# EAGLE design power-monitor (EAGLE 6.3)
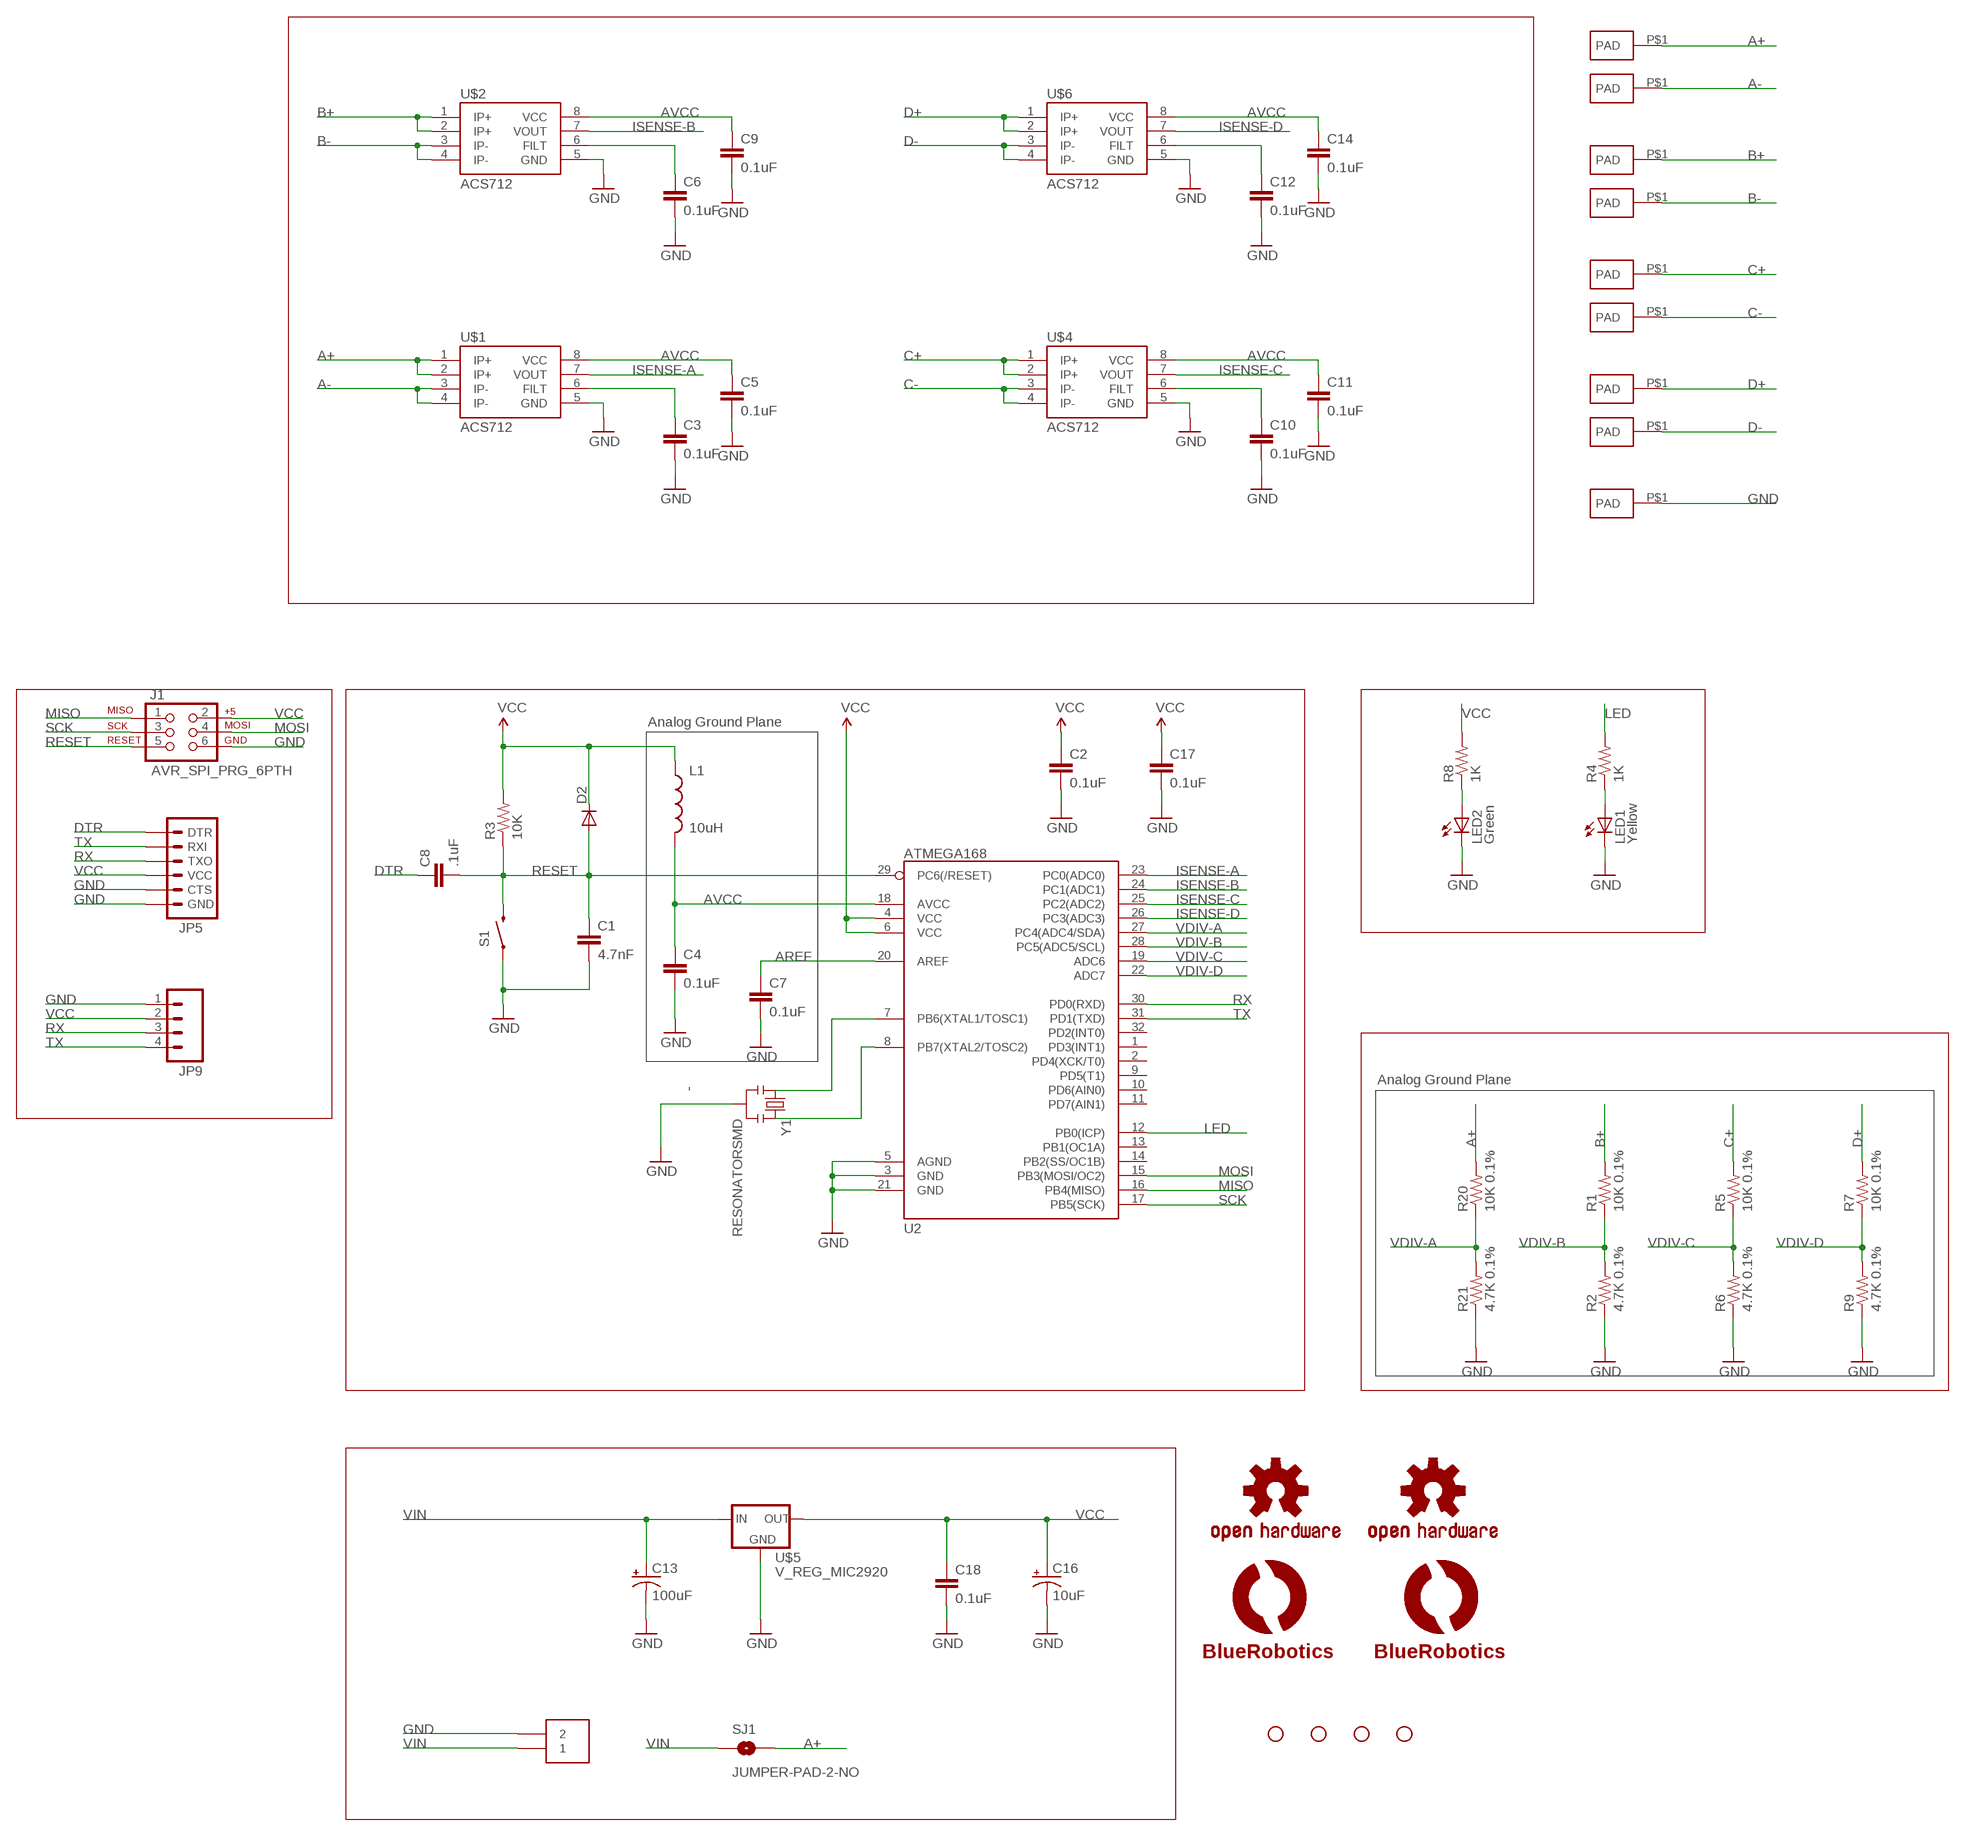
[diagram p0: schematic, sheet 1]

## Parts
C1  4.7nF  CAP0603-CAP  [0603-CAP]
C2  0.1uF  CAP0603-CAP  [0603-CAP]
C3  0.1uF  CAP0603-CAP  [0603-CAP]
C4  0.1uF  CAP0603-CAP  [0603-CAP]
C5  0.1uF  CAP0603-CAP  [0603-CAP]
C6  0.1uF  CAP0603-CAP  [0603-CAP]
C7  0.1uF  CAP0603-CAP  [0603-CAP]
C8  .1uF  CAP0603-CAP  [0603-CAP]
C9  0.1uF  CAP0603-CAP  [0603-CAP]
C10  0.1uF  CAP0603-CAP  [0603-CAP]
C11  0.1uF  CAP0603-CAP  [0603-CAP]
C12  0.1uF  CAP0603-CAP  [0603-CAP]
C13  100uF  CAP_POLPTH1  [CPOL-RADIAL-100UF-25V]
C14  0.1uF  CAP0603-CAP  [0603-CAP]
C16  10uF  CAP_POL1206  [EIA3216]
C17  0.1uF  CAP0603-CAP  [0603-CAP]
C18  0.1uF  CAP0603-CAP  [0603-CAP]
D2  DIODESOD  [SOD-323]
J1  AVR_SPI_PRG_6PTH  [2X3]
JP5  ARDUINO_SERIAL_PROGRAMPTH  [1X06]
JP9  M04PTH  [1X04]
L1  10uH  INDUCTOR0603  [0603]
LED1  Yellow  LED0603  [LED-0603]
LED2  Green  LED0603  [LED-0603]
LOGO1  OSHW-LOGOS  [OSHW-LOGO-S]
LOGO2  OSHW-LOGOM  [OSHW-LOGO-M]
R1  10K 0.1%  RESISTOR0603-RES  [0603-RES]
R2  4.7K 0.1%  RESISTOR0603-RES  [0603-RES]
R3  10K  RESISTOR0603-RES  [0603-RES]
R4  1K  RESISTOR0603-RES  [0603-RES]
R5  10K 0.1%  RESISTOR0603-RES  [0603-RES]
R6  4.7K 0.1%  RESISTOR0603-RES  [0603-RES]
R7  10K 0.1%  RESISTOR0603-RES  [0603-RES]
R8  1K  RESISTOR0603-RES  [0603-RES]
R9  4.7K 0.1%  RESISTOR0603-RES  [0603-RES]
R20  10K 0.1%  RESISTOR0603-RES  [0603-RES]
R21  4.7K 0.1%  RESISTOR0603-RES  [0603-RES]
S1  reset  SWITCH-MOMENTARY-2SMD  [TACTILE_SWITCH_SMD]
SJ1  JUMPER-PAD-2-NO  [PAD-JUMPER-2-NO_NO_SILK]
STANDOFF1  STAND-OFF  [STAND-OFF]
STANDOFF2  STAND-OFF  [STAND-OFF]
STANDOFF3  STAND-OFF  [STAND-OFF]
STANDOFF4  STAND-OFF  [STAND-OFF]
U2  ATMEGA168  [TQFP32-08]
U$1  ACS712  [SO08]
U$2  ACS712  [SO08]
U$3  TERMINAL-25MM-WEID  [LSF-SMT-5MM-2]
U$4  ACS712  [SO08]
U$5  V_REG_MIC2920  [SOT223]
U$6  ACS712  [SO08]
U$7  PADLARGE-ONE-SIDE  [PAD-0.2X0.3-ONE-SIDE]
U$8  PADLARGE-ONE-SIDE  [PAD-0.2X0.3-ONE-SIDE]
U$9  PADLARGE-ONE-SIDE  [PAD-0.2X0.3-ONE-SIDE]
U$10  PADLARGE-ONE-SIDE  [PAD-0.2X0.3-ONE-SIDE]
U$11  PADLARGE-ONE-SIDE  [PAD-0.2X0.3-ONE-SIDE]
U$13  PADLARGE-ONE-SIDE  [PAD-0.2X0.3-ONE-SIDE]
U$14  PADLARGE-ONE-SIDE  [PAD-0.2X0.3-ONE-SIDE]
U$15  PADLARGE-ONE-SIDE  [PAD-0.2X0.3-ONE-SIDE]
U$16  PADLARGE-ONE-SIDE  [PAD-0.2X0.3-ONE-SIDE]
U$17  LOGOBR-LOGO-M  [BR-LOGO-MEDIUM]
U$18  LOGOBR-LOGO-S  [BR-LOGO-SMALL]
Y1  RESONATORSMD  [RESONATOR-SMD]

## Nets
A+: R20.2 SJ1.2 U$1.1(IP+) U$1.2(IP+) U$13.P$1(PAD)
A-: U$1.3(IP-) U$1.4(IP-) U$14.P$1(PAD)
AREF: C7.1 U2.20(AREF)
AVCC: C4.1 C5.1 C9.1 C11.1 C14.1 L1.2 U2.18(AVCC) U$1.8(VCC) U$2.8(VCC) U$4.8(VCC) U$6.8(VCC)
B+: R1.2 U$2.1(IP+) U$2.2(IP+) U$15.P$1(PAD)
B-: U$2.3(IP-) U$2.4(IP-) U$16.P$1(PAD)
C+: R5.2 U$4.1(IP+) U$4.2(IP+) U$7.P$1(PAD)
C-: U$4.3(IP-) U$4.4(IP-) U$8.P$1(PAD)
D+: R7.2 U$6.1(IP+) U$6.2(IP+) U$9.P$1(PAD)
D-: U$6.3(IP-) U$6.4(IP-) U$10.P$1(PAD)
DTR: C8.1 JP5.1(DTR)
GND: C1.2 C2.2 C3.2 C4.2 C5.2 C6.2 C7.2 C9.2 C10.2 C11.2 C12.2 C13.2(-) C14.2 C16.C(-) C17.2 C18.2 J1.6 JP5.5(CTS) JP5.6(GND) JP9.1 LED1.C LED2.C R2.1 R6.1 R9.1 R21.1 S1.1 U2.3(GND) U2.5(AGND) U2.21(GND) U$1.5(GND) U$2.5(GND) U$3.2 U$3.4 U$4.5(GND) U$5.2(GND) U$6.5(GND) U$11.P$1(PAD) Y1.2
ISENSE-A: U2.23(PC0(ADC0)) U$1.7(VOUT)
ISENSE-B: U2.24(PC1(ADC1)) U$2.7(VOUT)
ISENSE-C: U2.25(PC2(ADC2)) U$4.7(VOUT)
ISENSE-D: U2.26(PC3(ADC3)) U$6.7(VOUT)
LED: R4.2 U2.12(PB0(ICP))
MISO: J1.1 U2.16(PB4(MISO))
MOSI: J1.4 U2.15(PB3(MOSI/OC2))
N$1: C6.1 U$2.6(FILT)
N$2: C3.1 U$1.6(FILT)
N$3: LED1.A R4.1
N$4: C10.1 U$4.6(FILT)
N$5: C12.1 U$6.6(FILT)
N$10: U2.7(PB6(XTAL1/TOSC1)) Y1.1
N$11: U2.8(PB7(XTAL2/TOSC2)) Y1.3
N$16: LED2.A R8.1
RESET: C1.1 C8.2 D2.2(A) J1.5 R3.1 S1.3 U2.29(PC6(/RESET))
RX: JP5.3(TXO) JP9.3 U2.30(PD0(RXD))
SCK: J1.3 U2.17(PB5(SCK))
TX: JP5.2(RXI) JP9.4 U2.31(PD1(TXD))
VCC: C2.1 C16.A(+) C17.1 C18.1 D2.1(C) J1.2 JP5.4(VCC) JP9.2 L1.1 R3.2 R8.2 U2.4(VCC) U2.6(VCC) U$5.3(OUT)
VDIV-A: R20.1 R21.2 U2.27(PC4(ADC4/SDA))
VDIV-B: R1.1 R2.2 U2.28(PC5(ADC5/SCL))
VDIV-C: R5.1 R6.2 U2.19(ADC6)
VDIV-D: R7.1 R9.2 U2.22(ADC7)
VIN: C13.1(+) SJ1.1 U$3.1 U$3.3 U$5.1(IN)
Unconnected: U2.1(PD3(INT1)) U2.2(PD4(XCK/T0)) U2.9(PD5(T1)) U2.10(PD6(AIN0)) U2.11(PD7(AIN1)) U2.13(PB1(OC1A)) U2.14(PB2(SS/OC1B)) U2.32(PD2(INT0))

## Notes on the sheet
- Analog Ground Plane
- Analog Ground Plane

## Library data of the parts
C1 C4 C7 C8 C18 = SparkFun:CAP: Capacitor Standard 0603 ceramic capacitor, and 0.1" leaded capacitor.
C2 C17 = SparkFun2:CAP: Capacitor Standard 0603 ceramic capacitor, and 0.1" leaded capacitor.
C3 C5 C6 C9-C12 C14 = SparkFun-Capacitors:CAP: Capacitor Standard 0603 ceramic capacitor, and 0.1" leaded capacitor.
C13 C16 = SparkFun:CAP_POL: Capacitor Polarized These are standard SMD and PTH capacitors. Normally 10uF, 47uF, and 100uF in electrolytic and tantalum varieties. Always verify the external diameter of the through hole cap, it varies with capacity, voltage, and manufacturer. The EIA devices should be standard.
D2 = SparkFun:DIODE: Diode These are standard reverse protection diodes and small signal diodes. SMA package can handle up to about 1A. SOD-323 can handle about 200mA. What the SOD-323 package when ordering, there are some mfgs out there that are 5-pin packages.
J1 = SparkFun:AVR_SPI_PRG_6: AVR ISP 6 Pin This is the reduced ISP connector for AVR programming. Common on Arduino. This footprint will take up less PCB space and can be used with a 10-pin to 6-pin adapter such as SKU: BOB-08508
JP5 = SparkFun:ARDUINO_SERIAL_PROGRAM
JP9 = SparkFun-Connectors:M04: Header 4 Standard 4-pin 0.1" header. Use with straight break away headers (SKU : PRT-00116), right angle break away headers (PRT-00553), swiss pins (PRT-00743), machine pins (PRT-00117), and female headers (PRT-00115). Molex polarized connector foot print use with SKU : PRT-08231 with associated crimp pins and housings. 1MM SMD Version SKU: PRT-10208
L1 = SparkFun:INDUCTOR: Inductors Basic Inductor/Choke - 0603 and 1206. Footprints are not proven and vary greatly between part numbers.
LED1 LED2 = SparkFun:LED: LEDs Standard schematic elements and footprints for 5mm, 3mm, 1206, and 0603 sized LEDs. 5mm - Spark Fun Electronics SKU : COM-00529 (and others)
LOGO1 LOGO2 = SparkFun-Aesthetics:OSHW-LOGO: Open Source Hardware Logo This logo indicates the piece of hardware it is found on incorporates a OSHW license and/or adheres to the definition of open source hardware found here: http://freedomdefined.org/OSHW
R1-R9 R20 R21 = SparkFun:RESISTOR: Resistor Basic schematic elements and footprints for 0603, 1206, and PTH resistors.
S1 = SparkFun:SWITCH-MOMENTARY-2
SJ1 = SparkFun-Passives:JUMPER-PAD-2-NO
STANDOFF1-STANDOFF4 = SparkFun-Electromechanical:STAND-OFF: #4 Stand Off This is the mechanical footprint for a #4 phillips button head screw. Use the keepout ring to avoid running the screw head into surrounding components. SKU : PRT-00447
U2 = SparkFun:ATMEGA168
U$1 U$2 U$4 U$6 = SparkFun-AnalogIC:ACS712: Hall-effect-based isolated linear current sensor
U$3 = AT-Parts-RJ:TERMINAL-2
U$5 = SparkFun:V_REG_MIC2920: MIC2920A (http://www.micrel.com/_PDF/mic2920.pdf) - 400mA output LDO Regulator
U$7-U$11 U$13-U$16 = AT-Parts-RJ:PAD
U$17 U$18 = BR-Eagle-Library:LOGO
Y1 = SparkFun:RESONATOR: Resonator Small SMD resonator. This is the itty bitty 10/20MHz resonators with built in caps. CSTCE10M0G55 and CSTCE20M0V53. Footprint has been reviewed closely but hasn't been tested yet.

## Board
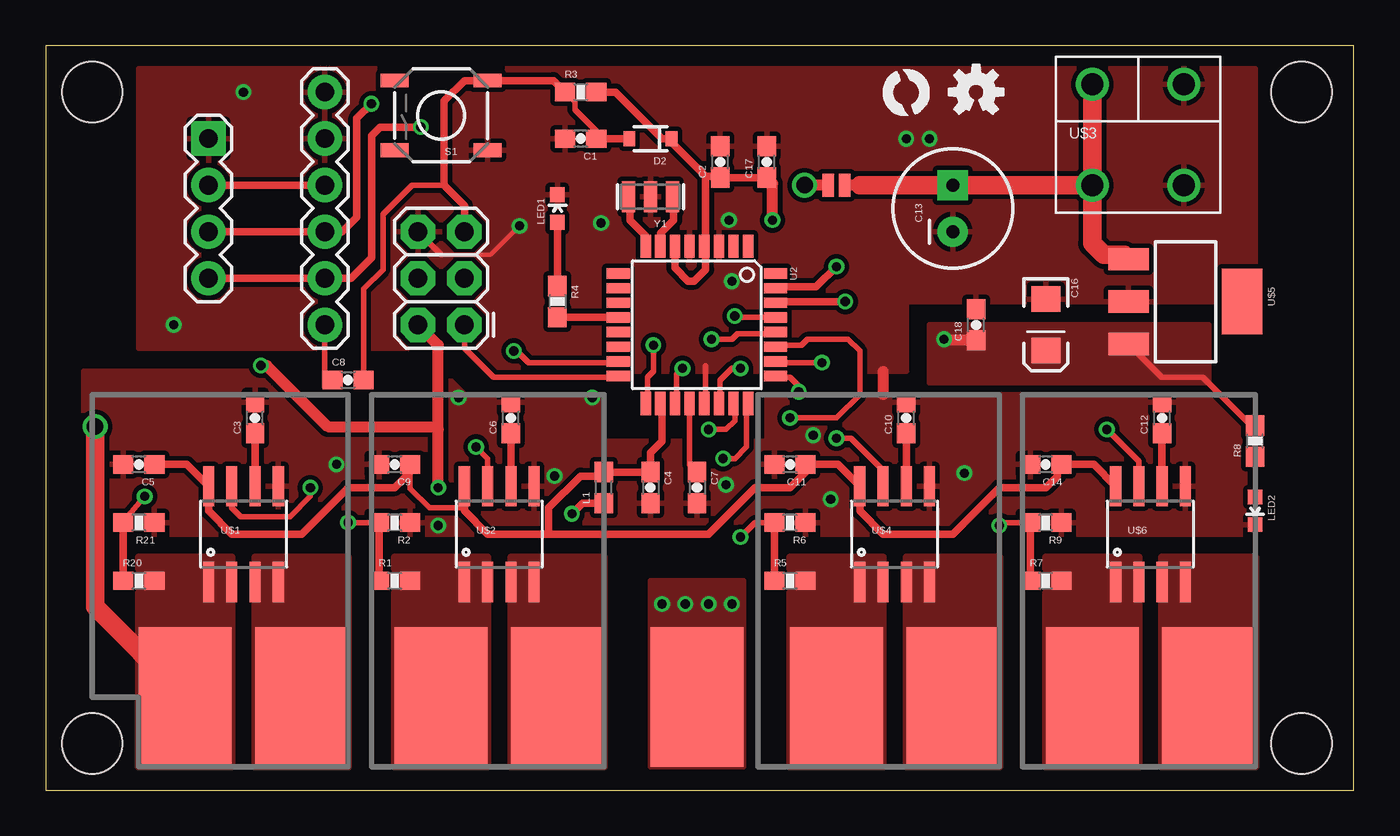
[diagram p1: board, top side]
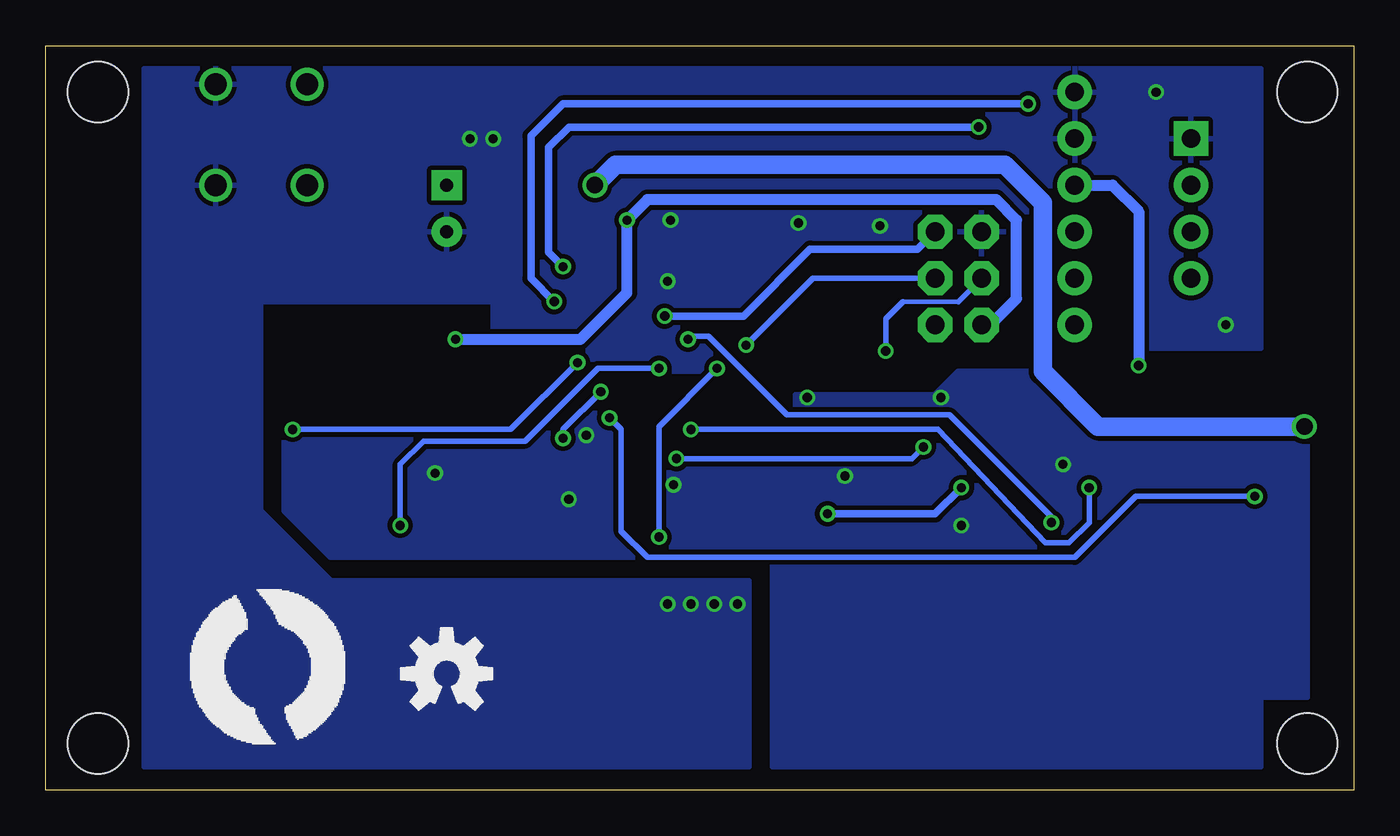
[diagram p2: board, bottom side, seen from below]

Size 71.42 x 40.63 mm. Coordinates in mm from the lower left corner, seen from the top.
Outline: 0,0 71.42,0 71.42,40.63 0,40.63 0,0
Copper layers (1*16): Top 0.0356mm / dielectric 1.5011mm / Bottom 0.0356mm
Design rules "OSH-Park": minimum track width 6mil, minimum drill 13mil, track to track 6mil, track to pad 6mil, pad to pad 6mil, via to via 6mil, smd to smd 6mil, copper to edge 15mil, drill to drill 6mil, minimum pad ring 7mil, minimum via ring 7mil, stop-mask expansion 3mil, vias tented up to drill 0mil, thermal gap 10mil

### Footprints (pad centres in the part's own frame; a part is rotated, then mirrored left to right if it is on the bottom)
0603-CAP = smd 1.1 x 1: 1 -0.85,0; 2 0.85,0
CPOL-RADIAL-100UF-25V = drill 0.7 pad 1.651 square: 1 1.27,0 | drill 0.7 pad 1.651: 2 -1.27,0
EIA3216 = smd 1.4 x 1.6: A 1.4,0; C -1.4,0
SOD-323 = smd 0.63 x 0.83: 1 -1.15,0; 2 1.15,0
2X3 = drill 1.016 pad 1.88 octagon: 1 0,0; 2 0,2.54; 3 2.54,0; 4 2.54,2.54; 5 5.08,0; 6 5.08,2.54
1X06 = drill 1.016 pad 1.88: 1 0,0; 2 2.54,0; 3 5.08,0; 4 7.62,0; 5 10.16,0; 6 12.7,0
1X04 = drill 1.016 pad 1.88 square: 1 0,0 | drill 1.016 pad 1.88: 2 2.54,0; 3 5.08,0; 4 7.62,0
0603 = smd 1.1 x 1: 1 -0.85,0; 2 0.85,0
LED-0603 = smd 0.8 x 0.8: A 0,-0.75; C 0,0.75
0603-RES = smd 1.1 x 1: 1 -0.85,0; 2 0.85,0
TACTILE_SWITCH_SMD = smd 1.524 x 0.762: 1 -2.54,1.905; 2 2.54,1.905; 3 -2.54,-1.905; 4 2.54,-1.905
PAD-JUMPER-2-NO_NO_SILK = smd 0.635 x 1.27: 1 -0.45,0; 2 0.45,0
STAND-OFF = hole 3.302: 0,0
TQFP32-08 = smd 1.27 x 0.559: 1 -4.293,2.8; 2 -4.293,2; 3 -4.293,1.2; 4 -4.293,0.4; 5 -4.293,-0.4; 6 -4.293,-1.2; 7 -4.293,-2; 8 -4.293,-2.8; 17 4.293,-2.8; 18 4.293,-2; 19 4.293,-1.2; 20 4.293,-0.4; 21 4.293,0.4; 22 4.293,1.2; 23 4.293,2; 24 4.293,2.8 | smd 0.559 x 1.27: 9 -2.8,-4.293; 10 -2,-4.293; 11 -1.2,-4.293; 12 -0.4,-4.293; 13 0.4,-4.293; 14 1.2,-4.293; 15 2,-4.293; 16 2.8,-4.293; 25 2.8,4.293; 26 2,4.293; 27 1.2,4.293; 28 0.4,4.293; 29 -0.4,4.293; 30 -1.2,4.293; 31 -2,4.293; 32 -2.8,4.293
SO08 = smd 0.61 x 2.21: 1 -1.905,-2.616; 2 -0.635,-2.616; 3 0.635,-2.616; 4 1.905,-2.616; 5 1.905,2.616; 6 0.635,2.616; 7 -0.635,2.616; 8 -1.905,2.616
LSF-SMT-5MM-2 = drill 1.2: 1 0,0; 2 5,0; 3 0,5.5; 4 5,5.5
SOT223 = smd 1.219 x 2.235: 1 -2.311,-3.099; 2 0,-3.099; 3 2.311,-3.099 | smd 3.6 x 2.2: 4 0,3.099
PAD-0.2X0.3-ONE-SIDE = smd 5.08 x 7.62: P$1 0,0
RESONATOR-SMD = smd 0.7 x 1.7: 1 -1.2,0; 2 0,0; 3 1.2,0

### Placement (x,y rotation side)
C1  29.21,35.56 180 top
C2  36.83,34.29 90 top
C3  11.43,20.32 90 top
C4  33.02,16.51 270 top
C5  5.08,17.78 180 top
C6  25.4,20.32 90 top
C7  35.56,16.51 270 top
C8  16.51,22.38 0 top
C9  19.05,17.78 180 top
C10  46.99,20.32 90 top
C11  40.64,17.78 180 top
C12  60.96,20.32 90 top
C13  49.53,31.75 90 top
C14  54.61,17.78 180 top
C16  54.61,25.4 270 top
C17  39.37,34.29 90 top
C18  50.8,25.4 90 top
D2  33.02,35.56 180 top
J1  22.86,25.4 90 top
JP5  15.24,25.4 90 top
JP9  8.89,35.56 270 top
L1  30.48,16.51 90 top
LED1  27.94,31.75 0 top
LED2  66.04,15.24 180 top
LOGO1  50.8,38.1 0 top
LOGO2  49.53,6.35 0 bottom
R1  19.05,11.43 0 top
R2  19.05,14.61 180 top
R3  29.21,38.1 0 top
R4  27.94,26.67 270 top
R5  40.64,11.43 0 top
R6  40.64,14.61 180 top
R7  54.61,11.43 0 top
R8  66.04,19.05 90 top
R9  54.61,14.61 180 top
R20  5.08,11.43 0 top
R21  5.08,14.61 180 top
S1  21.59,36.83 180 top
SJ1  43.18,33.02 180 top
STANDOFF1  2.54,2.54 0 top
STANDOFF2  68.58,2.54 0 top
STANDOFF3  2.54,38.1 0 top
STANDOFF4  68.58,38.1 0 top
U2  35.56,25.4 270 top
U$1  10.79,13.97 0 top
U$2  24.77,13.97 0 top
U$3  57.15,33.02 0 top
U$4  46.35,13.97 0 top
U$5  62.23,26.67 270 top
U$6  60.33,13.97 0 top
U$7  43.18,5.08 0 top
U$8  49.53,5.08 0 top
U$9  57.15,5.08 0 top
U$10  63.5,5.08 0 top
U$11  35.56,5.08 0 top
U$13  7.62,5.08 0 top
U$14  13.97,5.08 0 top
U$15  21.59,5.08 0 top
U$16  27.94,5.08 0 top
U$17  63.5,2.54 0 bottom
U$18  45.72,36.83 0 top
Y1  33.02,32.38 180 top

### Tracks (layer width: path | path; a pad name or v marks a point on that pad's centre or on a via)
A+  (via drill 0.9)
  Top 0.61: SJ1.2 v41.43,33.02
  Top 1.016: v2.7,19.84 2.7,10 U$13.P$1
  Bottom 1.016: v2.7,19.84 13.97,19.84 16.99,22.86 16.99,32.07 19.05,34.13 40.32,34.13 v41.43,33.02
  pour Top (no thermals): 5.08,1.27 10.16,1.27 10.16,12.7 5.08,12.7
A-
  pour Top (no thermals): 11.43,1.27 16.51,1.27 16.51,12.7 11.43,12.7
AREF
  Top 0.305: U2.20 35.16,17.76 C7.1
AVCC
  Top 0.305: C9.1 19.9,16.45 20.95,15.4 22.86,15.4
  Top 0.406: C5.1 7.7,17.78 U$1.8 8.89,15.24 10.16,13.97 13.97,13.97 16.51,16.51 19.05,16.51 19.68,17.14 19.68,17.57 C9.1 | U$6.8 57.23,17.78 C14.1 55.24,17.57 55.24,17.14 54.61,16.51 52.07,16.51 49.53,13.97 45.72,13.97 44.45,15.24 U$4.8 43.26,17.78 C11.1 41.49,17.36 40.64,16.51 38.73,16.51 36.2,13.97 27.3,13.97 | U2.18 33.66,21.01 33.66,19.05 33.02,18.41 C4.1 L1.2 30.27,17.14 29.21,17.14 27.46,15.4 27.46,14.13 27.3,13.97 | U$2.8 22.86,15.4 22.86,15.24 24.13,13.97 27.3,13.97
B+
  pour Top (no thermals): 19.05,1.27 24.13,1.27 24.13,12.7 19.05,12.7
B-
  pour Top (no thermals): 25.4,1.27 30.48,1.27 30.48,12.7 25.4,12.7
C+
  pour Top (no thermals): 40.64,1.27 45.72,1.27 45.72,12.7 40.64,12.7
C-
  pour Top (no thermals): 46.99,1.27 52.07,1.27 52.07,12.7 46.99,12.7
D+
  pour Top (no thermals): 54.61,1.27 59.69,1.27 59.69,12.7 54.61,12.7
D-
  pour Top (no thermals): 60.96,1.27 66.04,1.27 66.04,12.7 60.96,12.7
DTR
  Top 0.305: JP5.1 15.24,22.01 C8.1
GND  (via drill 0.5)
  Top 0.254: 21.59,29.21 24.29,29.21 v25.88,30.8
  Top 0.305: 36.04,21.11 36.04,21.59 | 36.04,21.59 36.04,23.18 | J1.6 21.59,29.21 | U2.21 35.96,21.51 36.04,21.59
  Top 0.61: 45.72,22.86 45.72,21.59
  other vias: 33.66,10.16 34.92,10.16 36.2,10.16 37.47,10.16 15.88,17.78 21.43,14.45 37.15,16.67 27.78,17.14 42.86,15.88 50.16,17.3 6.99,25.4 10.79,38.1 30.32,30.96 37.31,31.11 46.99,35.56 48.26,35.56 37.47,27.78 41.91,19.37 22.54,21.43 29.84,21.43
  pour Top (no thermals): 33.02,1.27 38.1,1.27 38.1,11.43 33.02,11.43
  pour Bottom: 33.02,1.27 33.02,11.43 55.88,11.43 59.69,15.24 59.69,39.37 66.04,39.37 66.04,1.27
  pour Top (isolate 0.254): 66.04,13.97 2.06,13.97 2.06,22.86 21.59,22.86 22.86,21.59 30.48,21.59 30.48,19.05 39.37,19.05 39.37,21.59 66.04,21.59
  pour Bottom (isolate 0.254): 5.08,1.27 5.08,5.08 2.54,5.08 2.54,22.86 21.59,22.86 22.86,21.59 30.48,21.59 30.48,19.05 39.37,19.05 39.37,21.59 58.42,21.59 58.42,15.24 55.88,12.7 31.75,12.7 31.75,1.27
  pour Top (isolate 0.254): 66.04,26.67 46.99,26.67 46.99,22.86 24.13,22.86 22.86,24.13 5.08,24.13 5.08,39.37 66.04,39.37
  pour Bottom (isolate 0.254): 66.04,26.67 46.99,26.67 46.99,22.86 24.13,22.86 22.86,24.13 5.08,24.13 5.08,39.37 66.04,39.37
ISENSE-A  (via drill 0.5)
  Top 0.305: U$1.7 10.16,15.4 10.64,14.92 13.34,14.92 14.45,16.03 v14.45,16.51 | v36.2,19.68 37.15,19.68 37.62,20.16 37.62,21.04 U2.23
  Bottom 0.305: v14.45,16.51 14.45,14.61 15.56,13.49 16.83,13.49 22.7,19.68 v36.2,19.68
ISENSE-B  (via drill 0.5)
  Top 0.305: U$2.7 24.13,18.1 v23.5,18.73 | v36.99,18.1 37.62,18.1 38.26,18.73 38.26,21.01 U2.24
  Bottom 0.305: v36.99,18.1 24.13,18.1 v23.5,18.73
ISENSE-C  (via drill 0.5)
  Top 0.305: U$4.7 45.72,17.46 43.97,19.21 v43.18,19.21 | v41.12,21.75 41.12,22.07 40.64,22.54 39.91,22.54 U2.25
  Bottom 0.305: v43.18,19.21 43.18,19.68 v41.12,21.75
ISENSE-D  (via drill 0.5)
  Top 0.305: U$6.7 59.69,17.94 v57.94,19.68 | v42.39,23.34 39.92,23.34 U2.26
  Bottom 0.305: v57.94,19.68 46.04,19.68 v42.39,23.34
LED
  Top 0.406: U2.12 27.96,25.8 R4.2
MISO
  Top 0.305: J1.1 22.86,24.13 24.45,22.54 31.21,22.54 U2.16
MOSI  (via drill 0.5)
  Top 0.305: v25.56,23.97 25.72,23.97 26.35,23.34 31.2,23.34 U2.15
  Bottom 0.254: 21.59,26.67 24.61,26.67
  Bottom 0.305: J1.4 21.59,26.67 | 24.61,26.67 25.56,25.72 v25.56,23.97
N$1
  Top 0.406: U$2.6 C6.1
N$2
  Top 0.406: C3.1 U$1.6
N$3
  Top 0.406: R4.1 LED1.A
N$4
  Top 0.406: C10.1 U$4.6
N$5
  Top 0.406: U$6.6 C12.1
N$10
  Top 0.406: U2.7 33.56,30.39 34.29,31.11 34.29,32.31 Y1.1
N$11
  Top 0.406: U2.8 32.76,30.26 31.91,31.11 31.91,32.3 Y1.3
N$16
  Top 0.305: LED2.A R8.1
RESET  (via drill 0.5)
  Top 0.305: C8.2 17.36,27.36 18.41,28.42 18.41,31.43 20,33.02 21.75,33.02 | C1.1 30.06,35.98 28.89,37.15 28.89,37.57 R3.1 | U2.29 37.7,25.8
  Top 0.406: J1.5 22.86,31.91 21.75,33.02 21.75,37.62 22.86,38.73 S1.3 27.73,38.73 R3.1 | 37.7,25.8 v37.62,25.88 | C1.1 D2.2
  Bottom 0.406: v37.62,25.88 33.34,25.88 29.69,29.53 23.81,29.53 J1.5
RX  (via drill 0.5)
  Top 0.406: JP9.3 JP5.3 16.19,30.48 16.99,31.27 16.99,36.67 v17.78,37.47 | v43.66,26.67 39.92,26.67 U2.30
  Bottom 0.406: v17.78,37.47 43.18,37.47 44.93,35.72 44.93,27.94 v43.66,26.67
SCK  (via drill 0.5)
  Top 0.305: v33.18,24.29 33.18,22.86 32.86,22.54 32.86,21.21 U2.17
  Bottom 0.305: J1.3 29.53,27.94 v33.18,24.29
TX  (via drill 0.5)
  Top 0.406: JP9.4 JP5.2 16.67,27.94 17.78,29.05 17.78,35.72 18.26,36.2 v20.48,36.2 | v43.18,28.57 42.07,27.46 39.92,27.46 U2.31
  Bottom 0.406: v20.48,36.2 42.86,36.2 43.97,35.08 43.97,29.37 v43.18,28.57
VCC  (via drill 0.5)
  Top 0.305: R8.2 65.83,19.9 63.18,22.54 60.95,22.54 U$5.3
  Top 0.406: R3.2 31.11,38.1 33.66,35.56 D2.1 34.17,35.36 36.04,33.5 | 36.04,33.5 36.77,33.5 C2.1 C17.1 | 36.04,33.5 36.04,29.77 U2.4 36.04,29.62 36.04,28.42 35.4,27.78 35.08,27.78 34.36,28.5 U2.6 | JP9.2 JP5.4 | L1.1 29.31,15.66 v28.73,15.08
  Top 0.61: C18.1 49.11,24.55 v49.05,24.61 | v39.69,31.11 39.69,33.12 C17.1 | v21.43,16.51 21.43,19.68 | 21.43,19.68 21.43,24.29 J1.2 | v11.75,23.18 12.06,23.18 15.4,19.84 21.27,19.84 21.43,19.68
  Bottom 0.406: v28.73,15.08 22.86,15.08 v21.43,16.51
  Bottom 0.61: v49.05,24.61 42.23,24.61 39.69,27.15 v39.69,31.11 38.58,32.23 19.53,32.23 18.41,31.11 18.41,26.83 19.84,25.4 J1.2 | JP5.4 13.18,33.02 11.75,31.59 v11.75,23.18
  pour Top (no thermals): 48.26,25.4 63.5,25.4 63.5,22.23 48.26,22.23
VDIV-A  (via drill 0.5)
  Top 0.305: R21.2 4.23,14.66 v5.4,16.03 | v40.64,20.32 43.18,20.32 44.45,21.59 44.45,23.97 43.81,24.61 41.59,24.61 41.27,24.29 39.94,24.29 U2.27
  Top 0.406: R20.1 R21.2
  Bottom 0.305: v5.4,16.03 11.91,16.03 15.24,12.7 38.58,12.7 40.01,14.13 40.01,19.68 v40.64,20.32
VDIV-B  (via drill 0.5)
  Top 0.305: R2.2 v16.51,14.61 | v36.35,24.61 37.47,24.61 37.78,24.92 39.78,24.92 U2.28
  Top 0.406: R1.1 R2.2
  Bottom 0.305: v16.51,14.61 16.51,14.92 22.07,20.48 30.96,20.48 35.24,24.77 36.2,24.77 v36.35,24.61
VDIV-C  (via drill 0.5)
  Top 0.305: R6.2 38.73,14.61 v37.94,13.81 | v34.77,23.02 34.45,22.7 34.45,21.2 U2.19
  Top 0.406: R5.1 R6.2
  Bottom 0.305: v37.94,13.81 37.94,19.84 v34.77,23.02
VDIV-D  (via drill 0.5)
  Top 0.305: R9.2 52.23,14.61 v52.07,14.45 | 36.67,21.2 U2.22 36.83,21.18 36.83,22.38 37.47,23.02 v37.94,23.02
  Top 0.406: R7.1 R9.2
  Bottom 0.305: v52.07,14.45 52.07,17.78 50.8,19.05 45.24,19.05 41.27,23.02 v37.94,23.02
VIN
  Top 0.61: 44.45,33.02 SJ1.1
  Top 1.016: U$3.3 U$3.1 | U$3.1 57.15,29.84 57.78,29.21 58.9,29.21 U$5.1 | U$3.1 C13.1 44.45,33.02

### Text on the board
tDocu: BLK | BlueRobotics / Power Monitor | GND | +Vin | rev 1 | +5V | Reset | GND | RX | Power / From A | Serial | Status | TX | FTDI | ISP | Power | GND | A+ | A- | B+ | B- | C+ | C- | D+ | D-
bDocu: Designed by R. Jehangir / July 2014